# EAGLE schematic NILMCape (EAGLE 6.4)

## Sheet 1 of 5
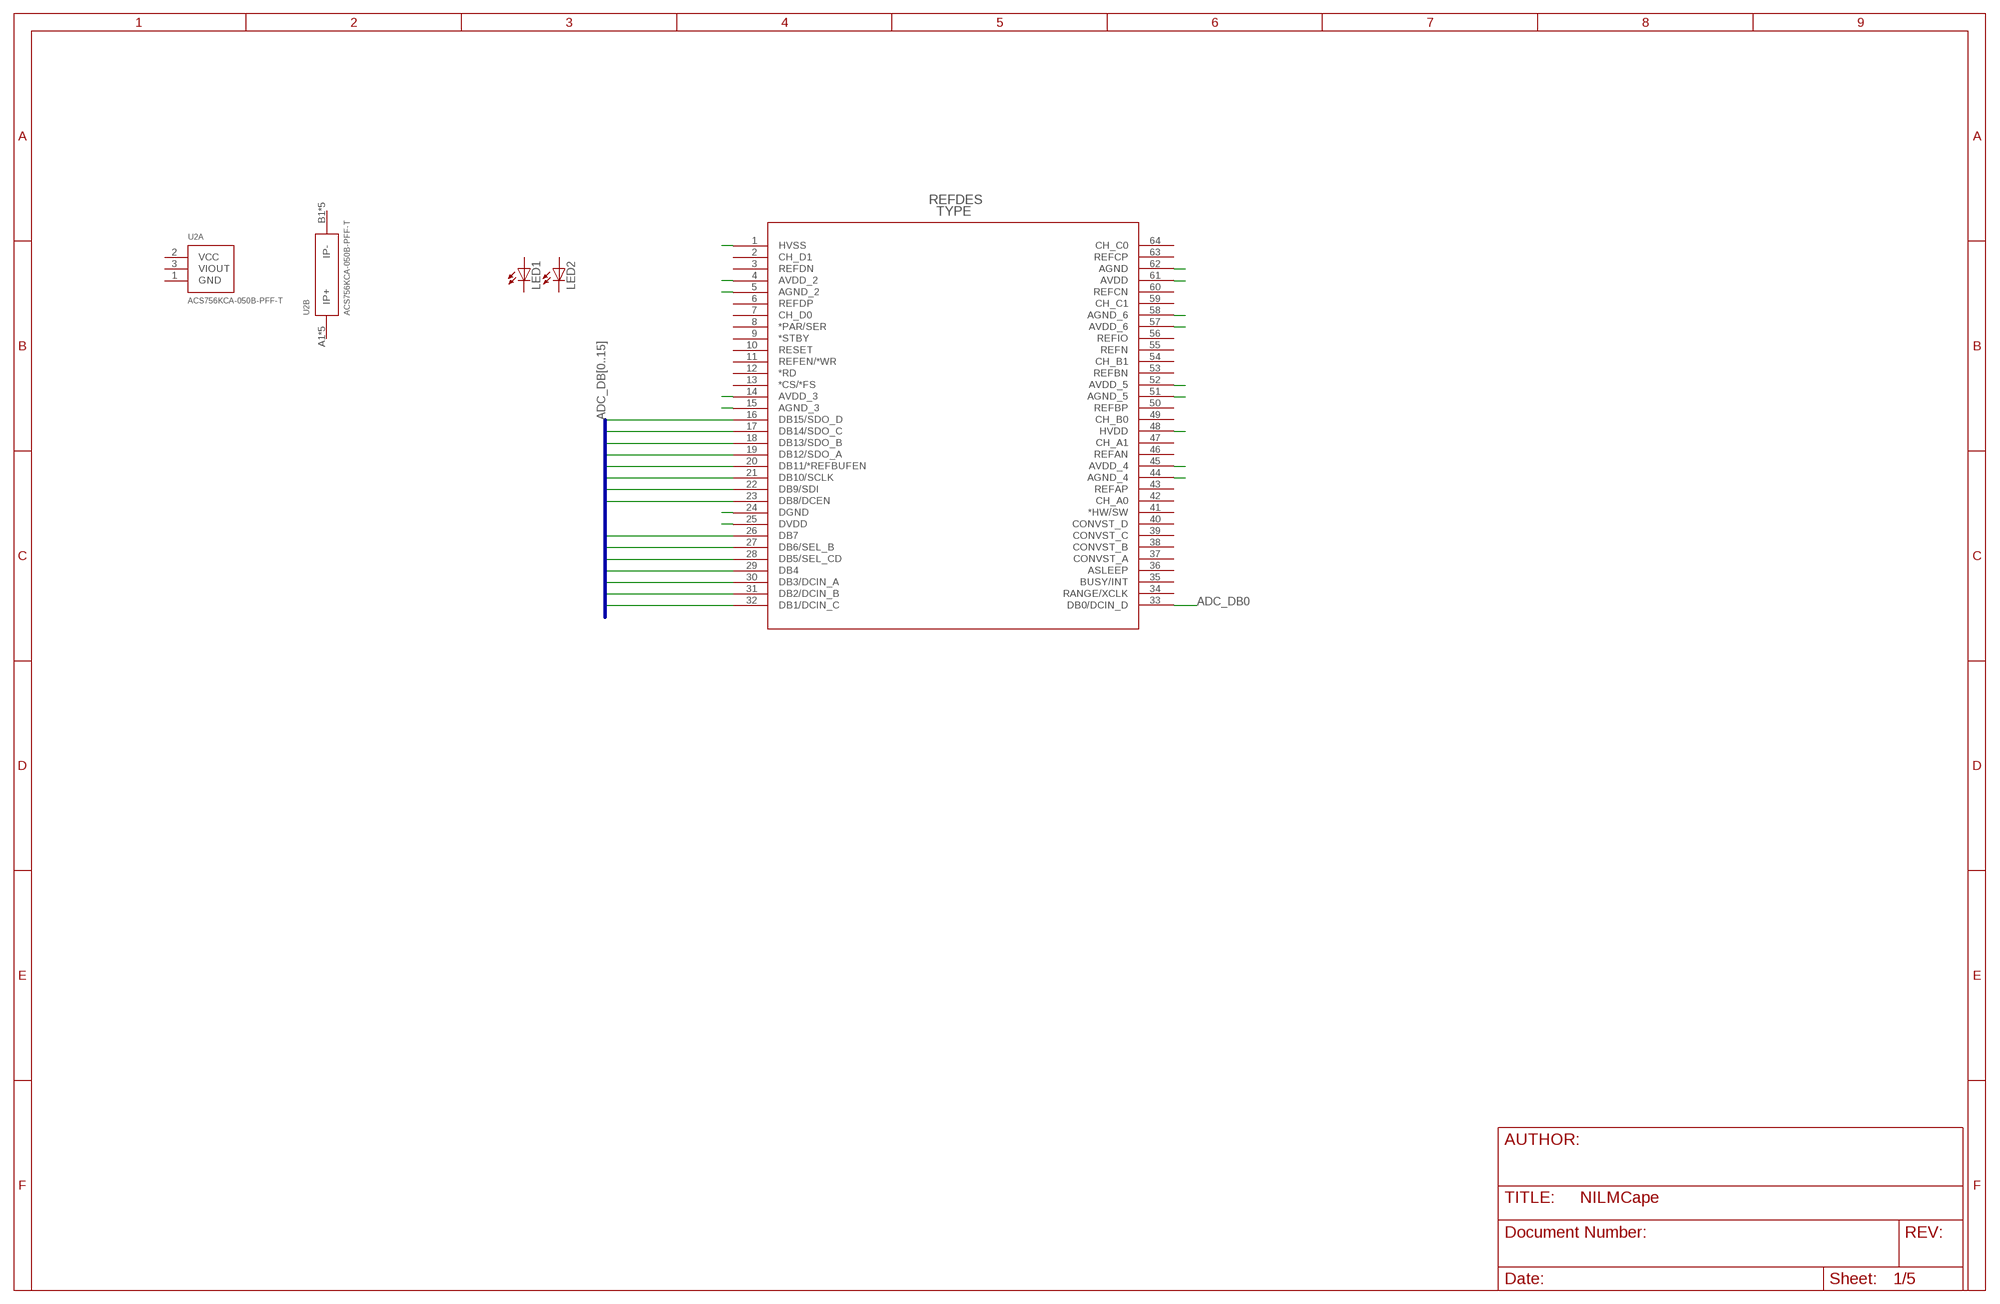
[diagram p0: schematic, sheet 1]

### Parts
LED1  LED0805  [LED-0805]
LED2  LED0805  [LED-0805]
U1  ADS8568_PM_64  [PM64]
U2  ACS756KCA-050B-PFF-T  [5PFF]

### Nets
ADC_DB0: U1.33(DB0/DCIN_D) ; also sheet 4
ADC_DB1: U1.32(DB1/DCIN_C) ; also sheet 4
ADC_DB2: U1.31(DB2/DCIN_B) ; also sheet 4
ADC_DB3: U1.30(DB3/DCIN_A) ; also sheet 4
ADC_DB4: U1.29(DB4) ; also sheet 4
ADC_DB5: U1.28(DB5/SEL_CD) ; also sheet 4
ADC_DB6: U1.27(DB6/SEL_B) ; also sheet 4
ADC_DB7: U1.26(DB7) ; also sheet 4
ADC_DB8: U1.23(DB8/DCEN) ; also sheet 4
ADC_DB9: U1.22(DB9/SDI) ; also sheet 4
ADC_DB10: U1.21(DB10/SCLK) ; also sheet 4
ADC_DB11: U1.20(DB11/*REFBUFEN) ; also sheet 4
ADC_DB12: U1.19(DB12/SDO_A) ; also sheet 4
ADC_DB13: U1.18(DB13/SDO_B) ; also sheet 4
ADC_DB14: U1.17(DB14/SDO_C) ; also sheet 4
ADC_DB15: U1.16(DB15/SDO_D) ; also sheet 4
HVSS: U1.1(HVSS) ; also sheet 2
N$6: U1.25(DVDD)
N$7: U1.14(AVDD_3)
N$8: U1.4(AVDD_2)
N$12: U1.5(AGND_2)
N$19: U1.15(AGND_3)
N$20: U1.24(DGND)
N$21: U1.44(AGND_4)
N$22: U1.45(AVDD_4)
N$23: U1.48(HVDD)
N$24: U1.51(AGND_5)
N$25: U1.52(AVDD_5)
N$26: U1.57(AVDD_6)
N$27: U1.58(AGND_6)
N$28: U1.61(AVDD)
N$29: U1.62(AGND)
Unconnected: LED1.1(A) LED1.2(C) LED2.1(A) LED2.2(C) U1.2(CH_D1) U1.3(REFDN) U1.6(REFDP) U1.7(CH_D0) U1.8(*PAR/SER) U1.9(*STBY) U1.10(RESET) U1.11(REFEN/*WR) U1.12(*RD) U1.13(*CS/*FS) U1.34(RANGE/XCLK) U1.35(BUSY/INT) U1.36(ASLEEP) U1.37(CONVST_A) U1.38(CONVST_B) U1.39(CONVST_C) U1.40(CONVST_D) U1.41(*HW/SW) U1.42(CH_A0) U1.43(REFAP) U1.46(REFAN) U1.47(CH_A1) U1.49(CH_B0) U1.50(REFBP) U1.53(REFBN) U1.54(CH_B1) U1.55(REFN) U1.56(REFIO) U1.59(CH_C1) U1.60(REFCN) U1.63(REFCP) U1.64(CH_C0) U2.1(A:GND) U2.2(A:VCC) U2.3(A:VIOUT) U2.A1(B:IP+) U2.A2(B:IP+) U2.A3(B:IP+) U2.A4(B:IP+) U2.A5(B:IP+) U2.B1(B:IP-) U2.B2(B:IP-) U2.B3(B:IP-) U2.B4(B:IP-) U2.B5(B:IP-)

### Buses
ADC_DB[0..15]

## Sheet 2 of 5
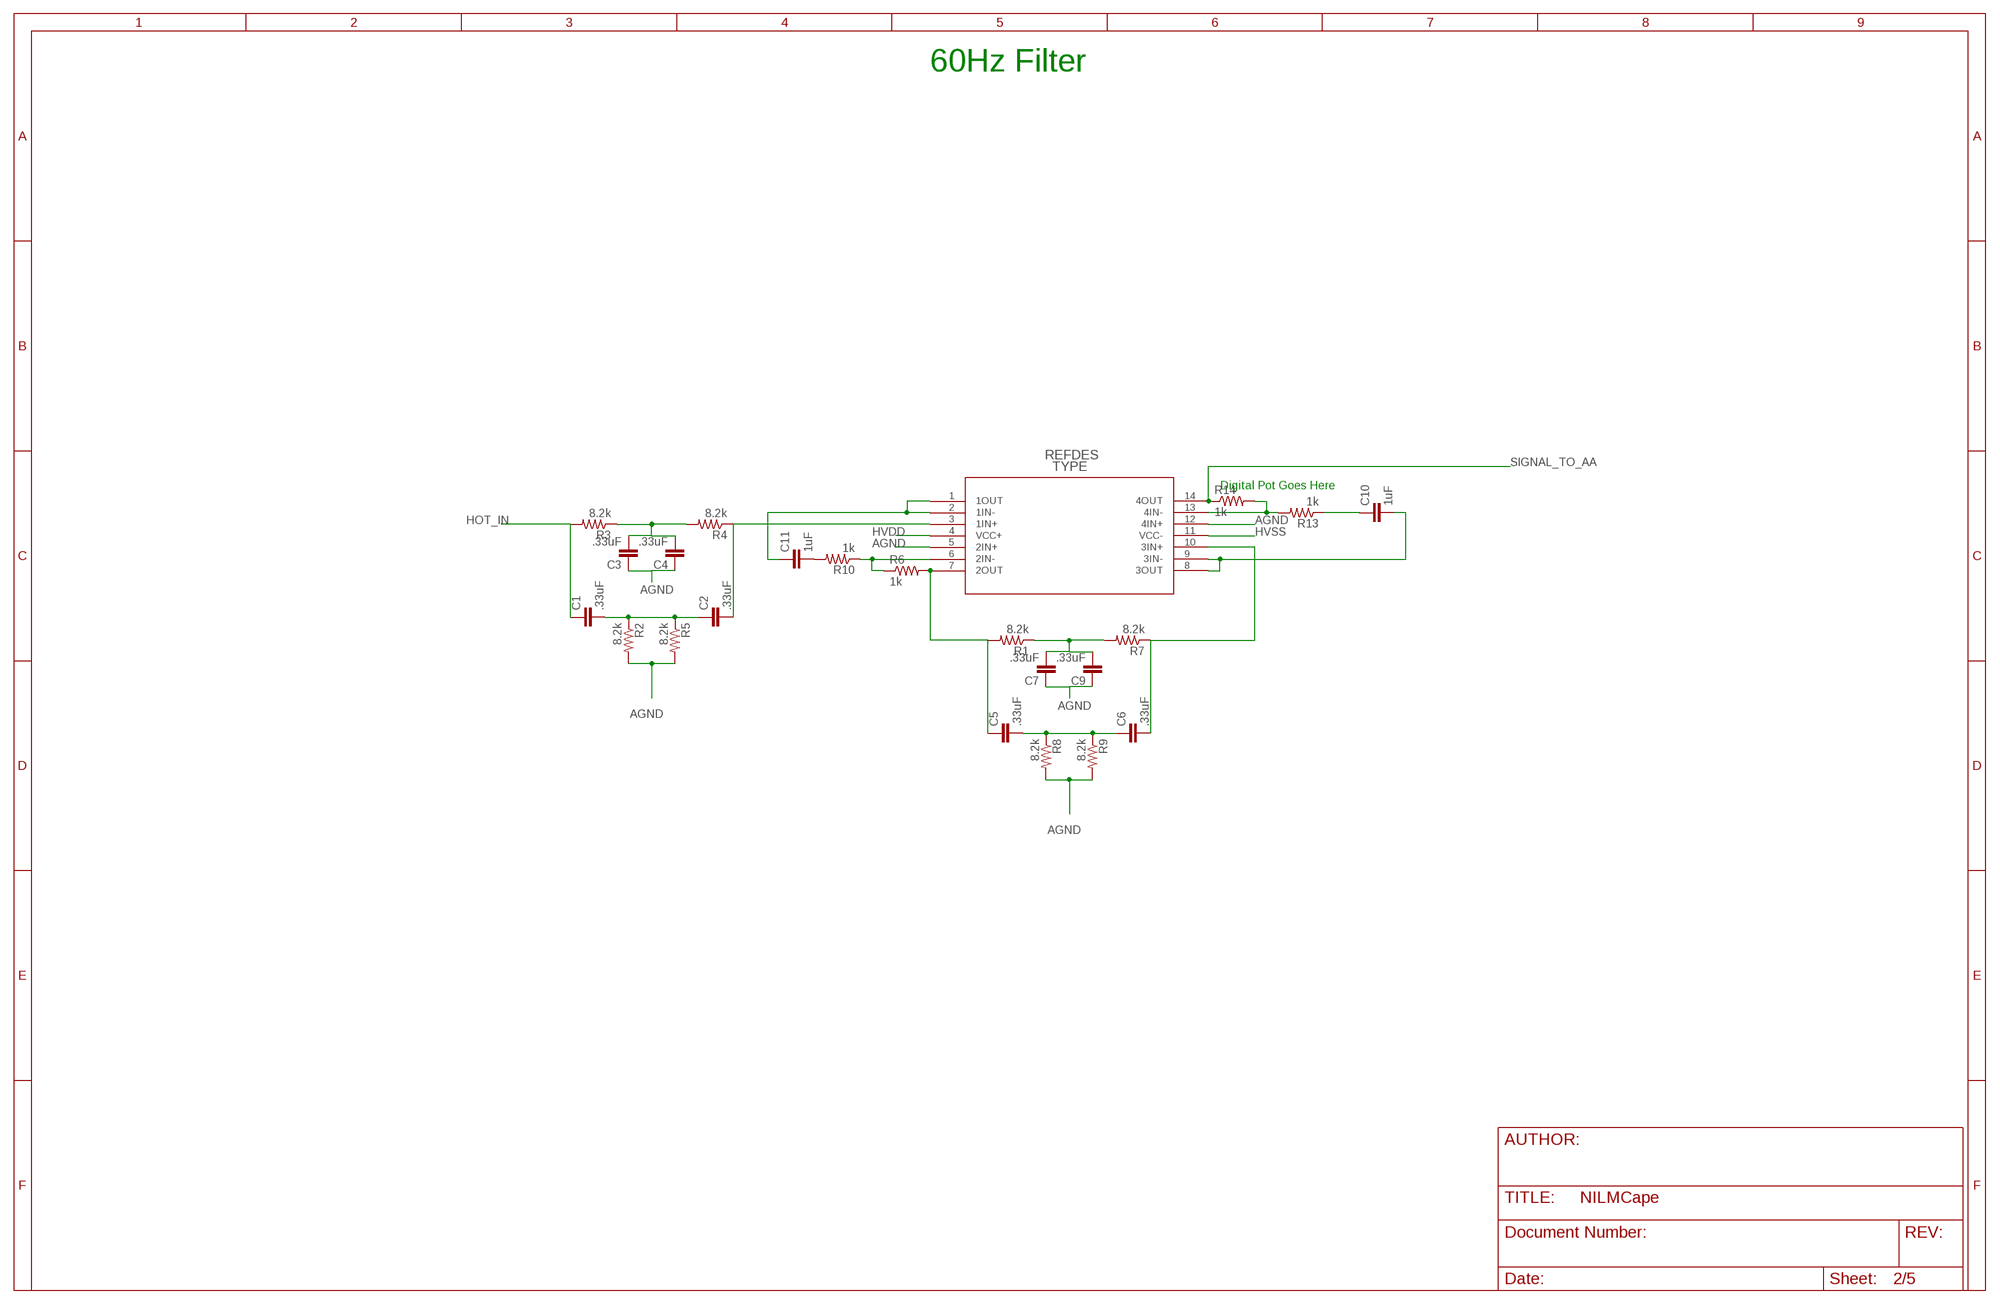
[diagram p1: schematic, sheet 2]

### Parts
C1  .33uF  CAP0805  [0805]
C2  .33uF  CAP0805  [0805]
C3  .33uF  CAP0805  [0805]
C4  .33uF  CAP0805  [0805]
C5  .33uF  CAP0805  [0805]
C6  .33uF  CAP0805  [0805]
C7  .33uF  CAP0805  [0805]
C9  .33uF  CAP0805  [0805]
C10  1uF  CAP0805  [0805]
C11  1uF  CAP0805  [0805]
R1  8.2k  RESISTOR0805-RES  [0805]
R2  8.2k  RESISTOR0805-RES  [0805]
R3  8.2k  RESISTOR0805-RES  [0805]
R4  8.2k  RESISTOR0805-RES  [0805]
R5  8.2k  RESISTOR0805-RES  [0805]
R6  1k  RESISTOR0805-RES  [0805]
R7  8.2k  RESISTOR0805-RES  [0805]
R8  8.2k  RESISTOR0805-RES  [0805]
R9  8.2k  RESISTOR0805-RES  [0805]
R10  1k  RESISTOR0805-RES  [0805]
R13  1k  RESISTOR0805-RES  [0805]
R14  1k  RESISTOR0805-RES  [0805]
U9  TL074_PW_14  [PW14]

### Nets
AGND: C3.1 C4.1 C7.1 C9.1 R2.2 R5.2 R8.2 R9.2 U9.5(2IN+) U9.12(4IN+)
HOT_IN: C1.1 R3.2
HVDD: U9.4(VCC+)
HVSS: U9.11(VCC-) ; also sheet 1
N$1: C5.1 R1.2 R6.2 U9.7(2OUT)
N$3: C1.2 C2.1 R2.1 R5.1
N$4: C3.2 C4.2 R3.1 R4.2
N$5: R6.1 R10.1 U9.6(2IN-)
N$9: C2.2 R4.1 U9.3(1IN+)
N$10: C5.2 C6.1 R8.1 R9.1
N$11: C7.2 C9.2 R1.1 R7.2
N$13: C6.2 R7.1 U9.10(3IN+)
N$14: C10.2 U9.8(3OUT) U9.9(3IN-)
N$17: R13.2 R14.2 U9.13(4IN-)
N$30: C10.1 R13.1
N$34: C11.2 R10.2
N$35: C11.1 U9.1(1OUT) U9.2(1IN-)
SIGNAL_TO_AA: R14.1 U9.14(4OUT)

### Notes on the sheet
- 60Hz Filter
- Digital Pot Goes Here

## Sheet 3 of 5
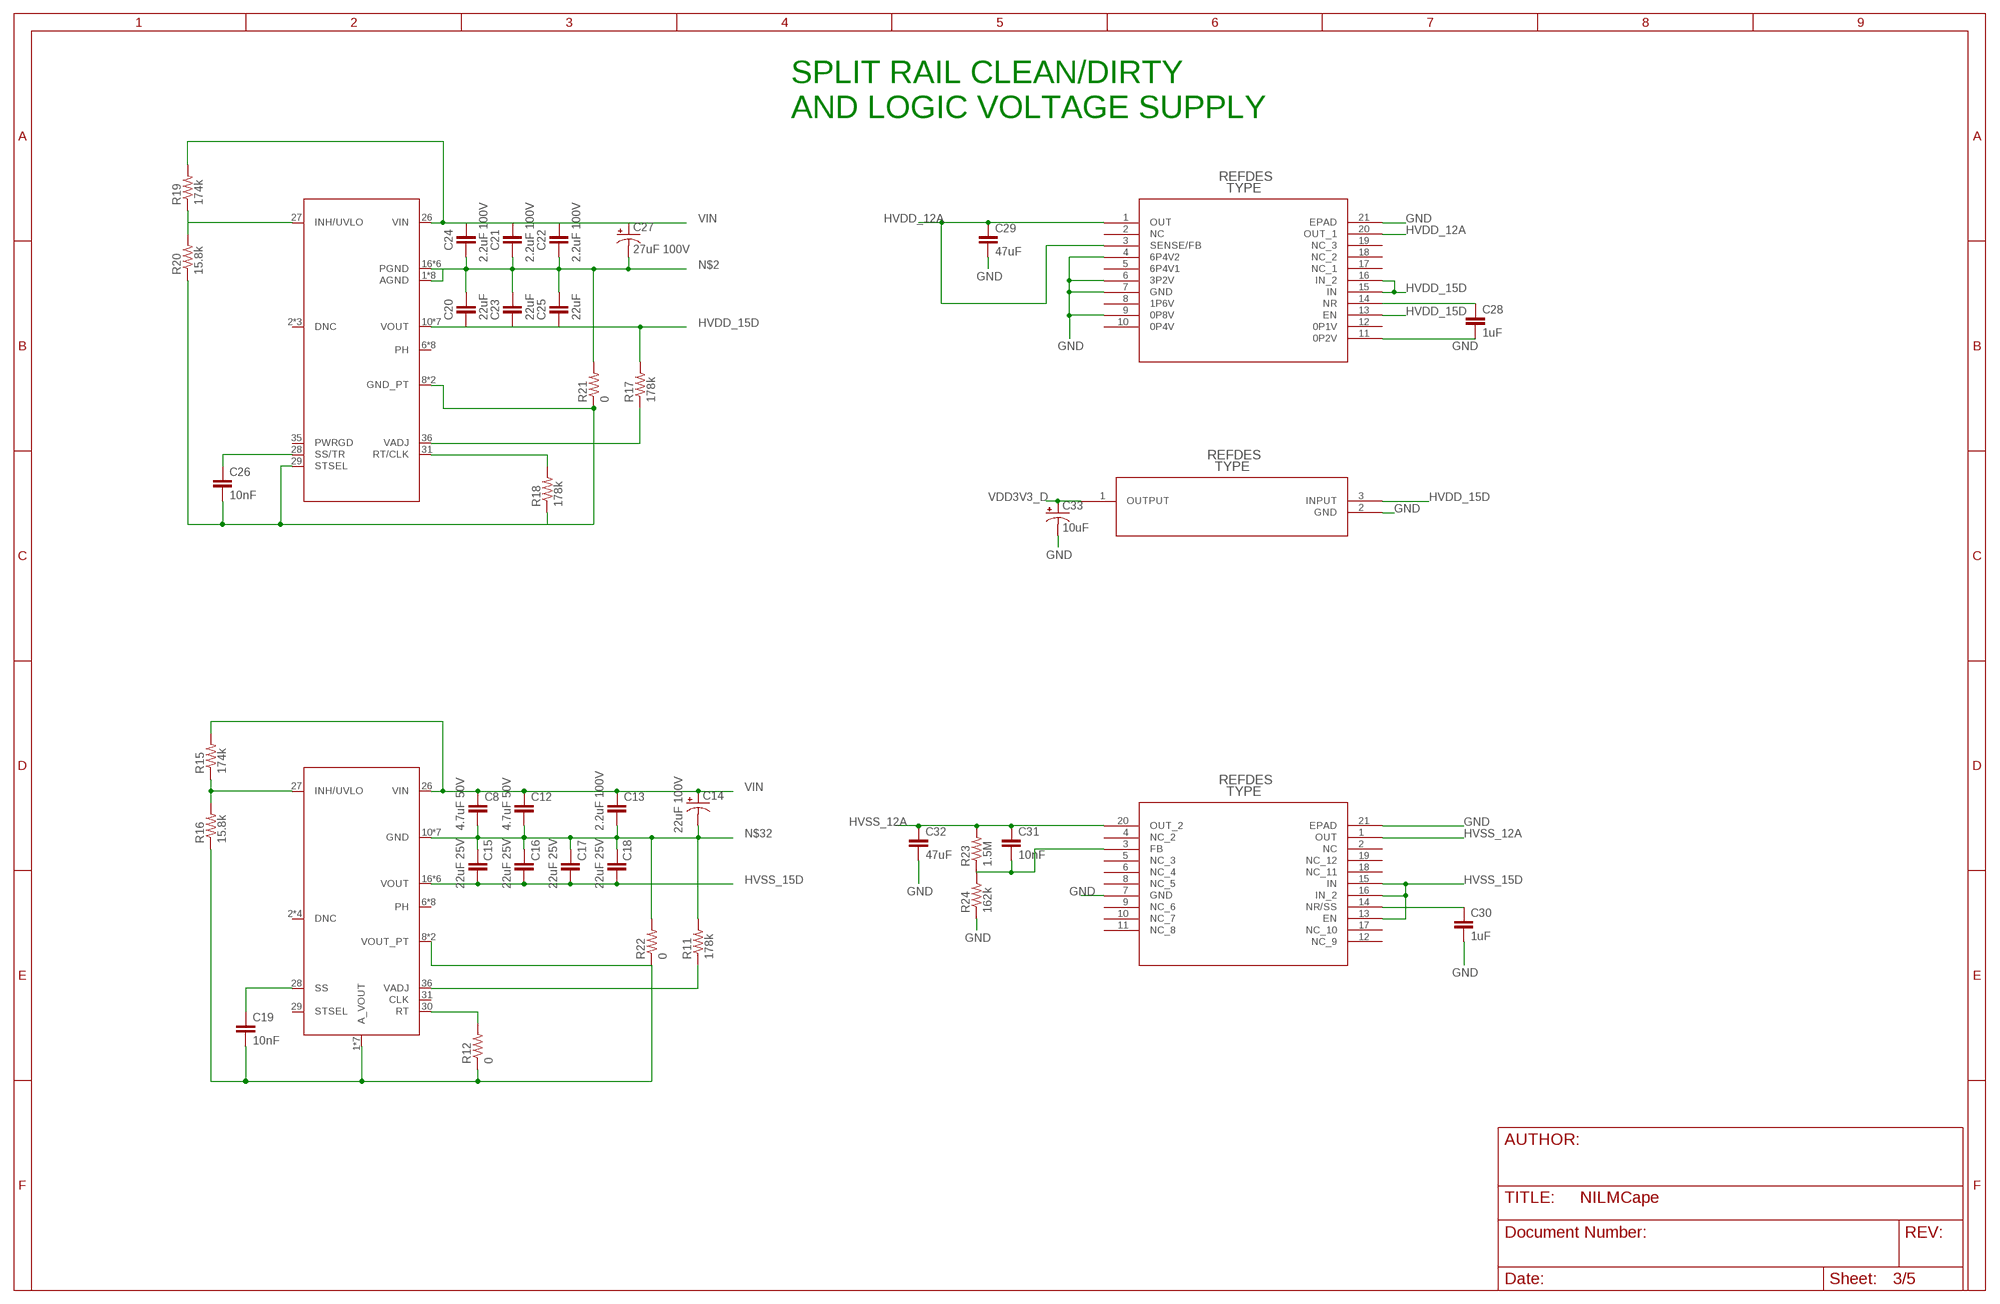
[diagram p2: schematic, sheet 3]

### Parts
C8  4.7uF 50V  CAP1210  [1210]
C12  4.7uF 50V  CAP1210  [1210]
C13  2.2uF 100V  CAP1210  [1210]
C14  22uF 100V  CAP_POLPTH1  [CPOL-RADIAL-100UF-25V]
C15  22uF 25V  CAP1210  [1210]
C16  22uF 25V  CAP1210  [1210]
C17  22uF 25V  CAP1210  [1210]
C18  22uF 25V  CAP1210  [1210]
C19  10nF  CAP0805  [0805]
C20  22uF  CAP1210  [1210]
C21  2.2uF 100V  CAP1210  [1210]
C22  2.2uF 100V  CAP1210  [1210]
C23  22uF  CAP1210  [1210]
C24  2.2uF 100V  CAP1210  [1210]
C25  22uF  CAP1210  [1210]
C26  10nF  CAP0805  [0805]
C27  27uF 100V  CAP_POLPTH1  [CPOL-RADIAL-100UF-25V]
C28  1uF  CAP0805  [0805]
C29  47uF  CAP1210  [1210]
C30  1uF  CAP0805  [0805]
C31  10nF  CAP0805  [0805]
C32  47uF  CAP1210  [1210]
C33  10uF  CAP_POLPTH2  [CPOL-RADIAL-10UF-25V]
R11  178k  RESISTOR0805-RES  [0805]
R12  0  RESISTOR0805-RES  [0805]
R15  174k  RESISTOR0805-RES  [0805]
R16  15.8k  RESISTOR0805-RES  [0805]
R17  178k  RESISTOR0805-RES  [0805]
R18  178k  RESISTOR0805-RES  [0805]
R19  174k  RESISTOR0805-RES  [0805]
R20  15.8k  RESISTOR0805-RES  [0805]
R21  0  RESISTOR0805-RES  [0805]
R22  0  RESISTOR0805-RES  [0805]
R23  1.5M  RESISTOR0805-RES  [0805]
R24  162k  RESISTOR0805-RES  [0805]
U5  TPS84250_RKG_41  [RKG41]
U6  TPS7A3301_RGW_20  [RGW20_3P15X3P15]
U7  LP2950-33_KVU_3  [KVU3]
U$2  TPS84259_RKG_41  [RKG41]
U$3  TPS7A4700_RGW_20  [RGW20_3P15X3P15]

### Nets
GND: C19.2 C28.2 C29.2 C30.2 C32.2 C33.2(-) R12.1 R16.1 R22.1 R24.1 U6.7(GND) U6.21(EPAD) U7.2(GND) U$2.1(A_VOUT) U$2.4(A_VOUT) U$2.5(A_VOUT) U$2.8(VOUT_PT) U$2.9(VOUT_PT) U$2.32(A_VOUT) U$2.33(A_VOUT) U$2.34(A_VOUT) U$2.37(A_VOUT) U$3.4(6P4V2) U$3.6(3P2V) U$3.7(GND) U$3.9(0P8V) U$3.11(0P2V) U$3.21(EPAD) ; also sheet 4
HVDD_12A: C29.1 U$3.1(OUT) U$3.3(SENSE/FB) U$3.20(OUT_1)
HVDD_15D: C20.2 C23.2 C25.2 R17.2 U5.10(VOUT) U5.11(VOUT) U5.12(VOUT) U5.13(VOUT) U5.14(VOUT) U5.15(VOUT) U5.39(VOUT) U7.3(INPUT) U$3.13(EN) U$3.15(IN) U$3.16(IN_2)
HVSS_12A: C31.1 C32.1 R23.2 U6.1(OUT) U6.20(OUT_2)
HVSS_15D: C15.2 C16.2 C17.2 C18.2 U6.13(EN) U6.15(IN) U6.16(IN_2) U$2.16(VOUT) U$2.17(VOUT) U$2.18(VOUT) U$2.19(VOUT) U$2.20(VOUT) U$2.40(VOUT)
N$2: C20.1 C21.2 C22.2 C23.1 C24.2 C25.1 C27.2(-) R21.2 U5.1(AGND) U5.4(AGND) U5.5(AGND) U5.16(PGND) U5.17(PGND) U5.18(PGND) U5.19(PGND) U5.20(PGND) U5.30(AGND) U5.32(AGND) U5.33(AGND) U5.34(AGND) U5.37(AGND) U5.40(PGND)
N$15: C19.1 U$2.28(SS)
N$16: C31.2 R24.2 U6.3(FB)
N$18: R11.1 U$2.36(VADJ)
N$31: R12.2 U$2.30(RT)
N$32: C8.2 C12.2 C13.2 C14.2(-) C15.1 C16.1 C17.1 C18.1 R11.2 R22.2 U$2.10(GND) U$2.11(GND) U$2.12(GND) U$2.13(GND) U$2.14(GND) U$2.15(GND) U$2.39(GND)
N$33: C30.1 U6.14(NR/SS)
N$36: R15.1 R16.2 U$2.27(INH/UVLO)
N$37: R17.1 U5.36(VADJ)
N$38: R18.2 U5.31(RT/CLK)
N$41: R19.1 R20.2 U5.27(INH/UVLO)
N$43: C26.1 U5.28(SS/TR)
N$44: C26.2 R18.1 R20.1 R21.1 U5.8(GND_PT) U5.9(GND_PT) U5.29(STSEL)
N$45: C28.1 U$3.14(NR)
VDD3V3_D: C33.1(+) U7.1(OUTPUT) ; also sheet 4
VIN: C8.1 C12.1 C13.1 C14.1(+) C21.1 C22.1 C24.1 C27.1(+) R15.2 R19.2 U5.26(VIN) U$2.26(VIN)
Unconnected: R23.1 U5.2(DNC) U5.3(DNC) U5.6(PH) U5.7(PH) U5.21(PH) U5.22(PH) U5.23(PH) U5.24(PH) U5.25(DNC) U5.35(PWRGD) U5.38(PH) U5.41(PH) U6.2(NC) U6.4(NC_2) U6.5(NC_3) U6.6(NC_4) U6.8(NC_5) U6.9(NC_6) U6.10(NC_7) U6.11(NC_8) U6.12(NC_9) U6.17(NC_10) U6.18(NC_11) U6.19(NC_12) U$2.2(DNC) U$2.3(DNC) U$2.6(PH) U$2.7(PH) U$2.21(PH) U$2.22(PH) U$2.23(PH) U$2.24(PH) U$2.25(DNC) U$2.29(STSEL) U$2.31(CLK) U$2.35(DNC) U$2.38(PH) U$2.41(PH) U$3.2(NC) U$3.5(6P4V1) U$3.8(1P6V) U$3.10(0P4V) U$3.12(0P1V) U$3.17(NC_1) U$3.18(NC_2) U$3.19(NC_3)

### Notes on the sheet
- SPLIT RAIL CLEAN/DIRTY
  AND LOGIC VOLTAGE SUPPLY

## Sheet 4 of 5
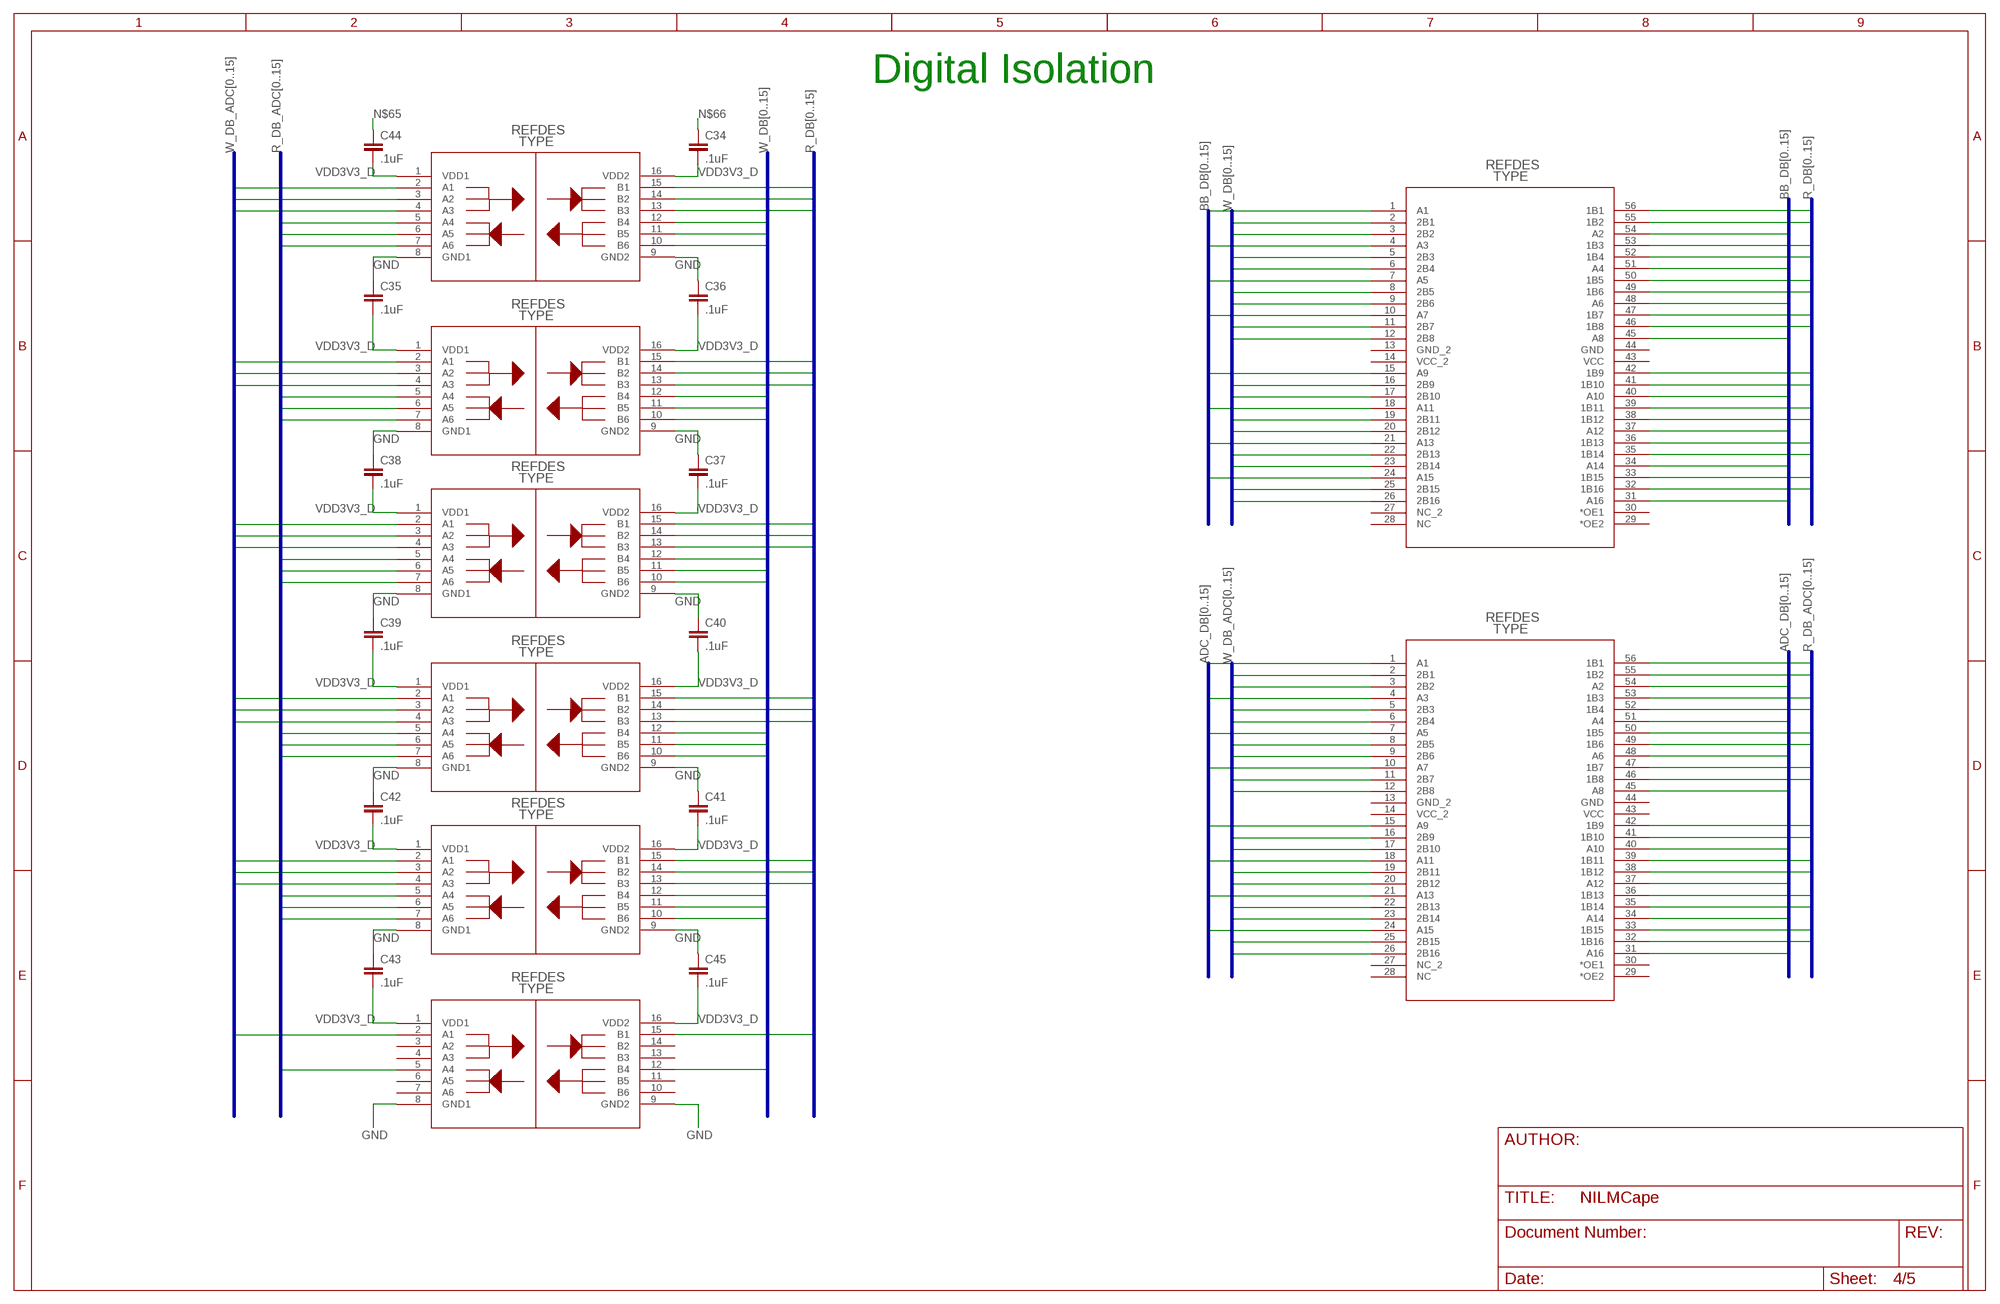
[diagram p3: schematic, sheet 4]

### Parts
C34  .1uF  CAP0805  [0805]
C35  .1uF  CAP0805  [0805]
C36  .1uF  CAP0805  [0805]
C37  .1uF  CAP0805  [0805]
C38  .1uF  CAP0805  [0805]
C39  .1uF  CAP0805  [0805]
C40  .1uF  CAP0805  [0805]
C41  .1uF  CAP0805  [0805]
C42  .1uF  CAP0805  [0805]
C43  .1uF  CAP0805  [0805]
C44  .1uF  CAP0805  [0805]
C45  .1uF  CAP0805  [0805]
U3  SI8663BC-B-IS1  [SOIC-16]
U4  SN74CBT16390_DGG  [DGG56]
U8  SI8663BC-B-IS1  [SOIC-16]
U10  SI8663BC-B-IS1  [SOIC-16]
U11  SI8663BC-B-IS1  [SOIC-16]
U12  SI8663BC-B-IS1  [SOIC-16]
U13  SI8663BC-B-IS1  [SOIC-16]
U14  SN74CBT16390_DGG  [DGG56]

### Nets
ADC_DB0: U14.1(A1) ; also sheet 1
ADC_DB1: U14.54(A2) ; also sheet 1
ADC_DB2: U14.4(A3) ; also sheet 1
ADC_DB3: U14.51(A4) ; also sheet 1
ADC_DB4: U14.7(A5) ; also sheet 1
ADC_DB5: U14.48(A6) ; also sheet 1
ADC_DB6: U14.10(A7) ; also sheet 1
ADC_DB7: U14.45(A8) ; also sheet 1
ADC_DB8: U14.15(A9) ; also sheet 1
ADC_DB9: U14.40(A10) ; also sheet 1
ADC_DB10: U14.18(A11) ; also sheet 1
ADC_DB11: U14.37(A12) ; also sheet 1
ADC_DB12: U14.21(A13) ; also sheet 1
ADC_DB13: U14.34(A14) ; also sheet 1
ADC_DB14: U14.24(A15) ; also sheet 1
ADC_DB15: U14.31(A16) ; also sheet 1
BB_DB0: U4.1(A1) ; also sheet 5
BB_DB1: U4.54(A2) ; also sheet 5
BB_DB2: U4.4(A3) ; also sheet 5
BB_DB3: U4.51(A4) ; also sheet 5
BB_DB4: U4.7(A5) ; also sheet 5
BB_DB5: U4.48(A6) ; also sheet 5
BB_DB6: U4.10(A7) ; also sheet 5
BB_DB7: U4.45(A8) ; also sheet 5
BB_DB8: U4.15(A9) ; also sheet 5
BB_DB9: U4.40(A10) ; also sheet 5
BB_DB10: U4.18(A11) ; also sheet 5
BB_DB11: U4.37(A12) ; also sheet 5
BB_DB12: U4.21(A13) ; also sheet 5
BB_DB13: U4.34(A14) ; also sheet 5
BB_DB14: U4.24(A15) ; also sheet 5
BB_DB15: U4.31(A16) ; also sheet 5
GND: C35.1 C36.1 C37.1 C38.1 C39.1 C40.1 C41.1 C42.1 C43.1 C45.1 U3.8(GND1) U3.9(GND2) U8.8(GND1) U8.9(GND2) U10.8(GND1) U10.9(GND2) U11.8(GND1) U11.9(GND2) U12.8(GND1) U12.9(GND2) U13.8(GND1) U13.9(GND2) ; also sheet 3
N$65: C44.1
N$66: C34.1
R_DB0: U4.56(1B1) U12.15(B1)
R_DB1: U4.55(1B2) U12.14(B2)
R_DB2: U4.53(1B3) U12.13(B3)
R_DB3: U4.52(1B4) U11.15(B1)
R_DB4: U4.50(1B5) U11.14(B2)
R_DB5: U4.49(1B6) U11.13(B3)
R_DB6: U4.47(1B7) U10.15(B1)
R_DB7: U4.46(1B8) U10.14(B2)
R_DB8: U4.42(1B9) U10.13(B3)
R_DB9: U3.15(B1) U4.41(1B10)
R_DB10: U3.14(B2) U4.39(1B11)
R_DB11: U3.13(B3) U4.38(1B12)
R_DB12: U4.36(1B13) U8.15(B1)
R_DB13: U4.35(1B14) U8.14(B2)
R_DB14: U4.33(1B15) U8.13(B3)
R_DB15: U4.32(1B16) U13.15(B1)
R_DB_ADC0: U12.5(A4) U14.56(1B1)
R_DB_ADC1: U12.6(A5) U14.55(1B2)
R_DB_ADC2: U12.7(A6) U14.53(1B3)
R_DB_ADC3: U11.5(A4) U14.52(1B4)
R_DB_ADC4: U11.6(A5) U14.50(1B5)
R_DB_ADC5: U11.7(A6) U14.49(1B6)
R_DB_ADC6: U10.5(A4) U14.47(1B7)
R_DB_ADC7: U10.6(A5) U14.46(1B8)
R_DB_ADC8: U10.7(A6) U14.42(1B9)
R_DB_ADC9: U3.5(A4) U14.41(1B10)
R_DB_ADC10: U3.6(A5) U14.39(1B11)
R_DB_ADC11: U3.7(A6) U14.38(1B12)
R_DB_ADC12: U8.5(A4) U14.36(1B13)
R_DB_ADC13: U8.6(A5) U14.35(1B14)
R_DB_ADC14: U8.7(A6) U14.33(1B15)
R_DB_ADC15: U13.5(A4) U14.32(1B16)
VDD3V3_D: C34.2 C35.2 C36.2 C37.2 C38.2 C39.2 C40.2 C41.2 C42.2 C43.2 C44.2 C45.2 U3.1(VDD1) U3.16(VDD2) U8.1(VDD1) U8.16(VDD2) U10.1(VDD1) U10.16(VDD2) U11.1(VDD1) U11.16(VDD2) U12.1(VDD1) U12.16(VDD2) U13.1(VDD1) U13.16(VDD2) ; also sheet 3
W_DB0: U4.2(2B1) U12.12(B4)
W_DB1: U4.3(2B2) U12.11(B5)
W_DB2: U4.5(2B3) U12.10(B6)
W_DB3: U4.6(2B4) U11.12(B4)
W_DB4: U4.8(2B5) U11.11(B5)
W_DB5: U4.9(2B6) U11.10(B6)
W_DB6: U4.11(2B7) U10.12(B4)
W_DB7: U4.12(2B8) U10.11(B5)
W_DB8: U4.16(2B9) U10.10(B6)
W_DB9: U3.12(B4) U4.17(2B10)
W_DB10: U3.11(B5) U4.19(2B11)
W_DB11: U3.10(B6) U4.20(2B12)
W_DB12: U4.22(2B13) U8.12(B4)
W_DB13: U4.23(2B14) U8.11(B5)
W_DB14: U4.25(2B15) U8.10(B6)
W_DB15: U4.26(2B16) U13.12(B4)
W_DB_ADC0: U12.2(A1) U14.2(2B1)
W_DB_ADC1: U12.3(A2) U14.3(2B2)
W_DB_ADC2: U12.4(A3) U14.5(2B3)
W_DB_ADC3: U11.2(A1) U14.6(2B4)
W_DB_ADC4: U11.3(A2) U14.8(2B5)
W_DB_ADC5: U14.9(2B6)
W_DB_ADC6: U10.2(A1) U11.4(A3) U14.11(2B7)
W_DB_ADC7: U10.3(A2) U14.12(2B8)
W_DB_ADC8: U10.4(A3) U14.16(2B9)
W_DB_ADC9: U3.2(A1) U14.17(2B10)
W_DB_ADC10: U3.3(A2) U14.19(2B11)
W_DB_ADC11: U3.4(A3) U14.20(2B12)
W_DB_ADC12: U8.2(A1) U14.22(2B13)
W_DB_ADC13: U8.3(A2) U14.23(2B14)
W_DB_ADC14: U8.4(A3) U14.25(2B15)
W_DB_ADC15: U13.2(A1) U14.26(2B16)
Unconnected: U4.13(GND_2) U4.14(VCC_2) U4.27(NC_2) U4.28(NC) U4.29(*OE2) U4.30(*OE1) U4.43(VCC) U4.44(GND) U13.3(A2) U13.4(A3) U13.6(A5) U13.7(A6) U13.10(B6) U13.11(B5) U13.13(B3) U13.14(B2) U14.13(GND_2) U14.14(VCC_2) U14.27(NC_2) U14.28(NC) U14.29(*OE2) U14.30(*OE1) U14.43(VCC) U14.44(GND)

### Buses
BB_DB[0..15]
W_DB[0..15]
R_DB[0..15]
W_DB_ADC[0..15]
R_DB_ADC[0..15]
ADC_DB[0..15]

### Notes on the sheet
- Digital Isolation

## Sheet 5 of 5
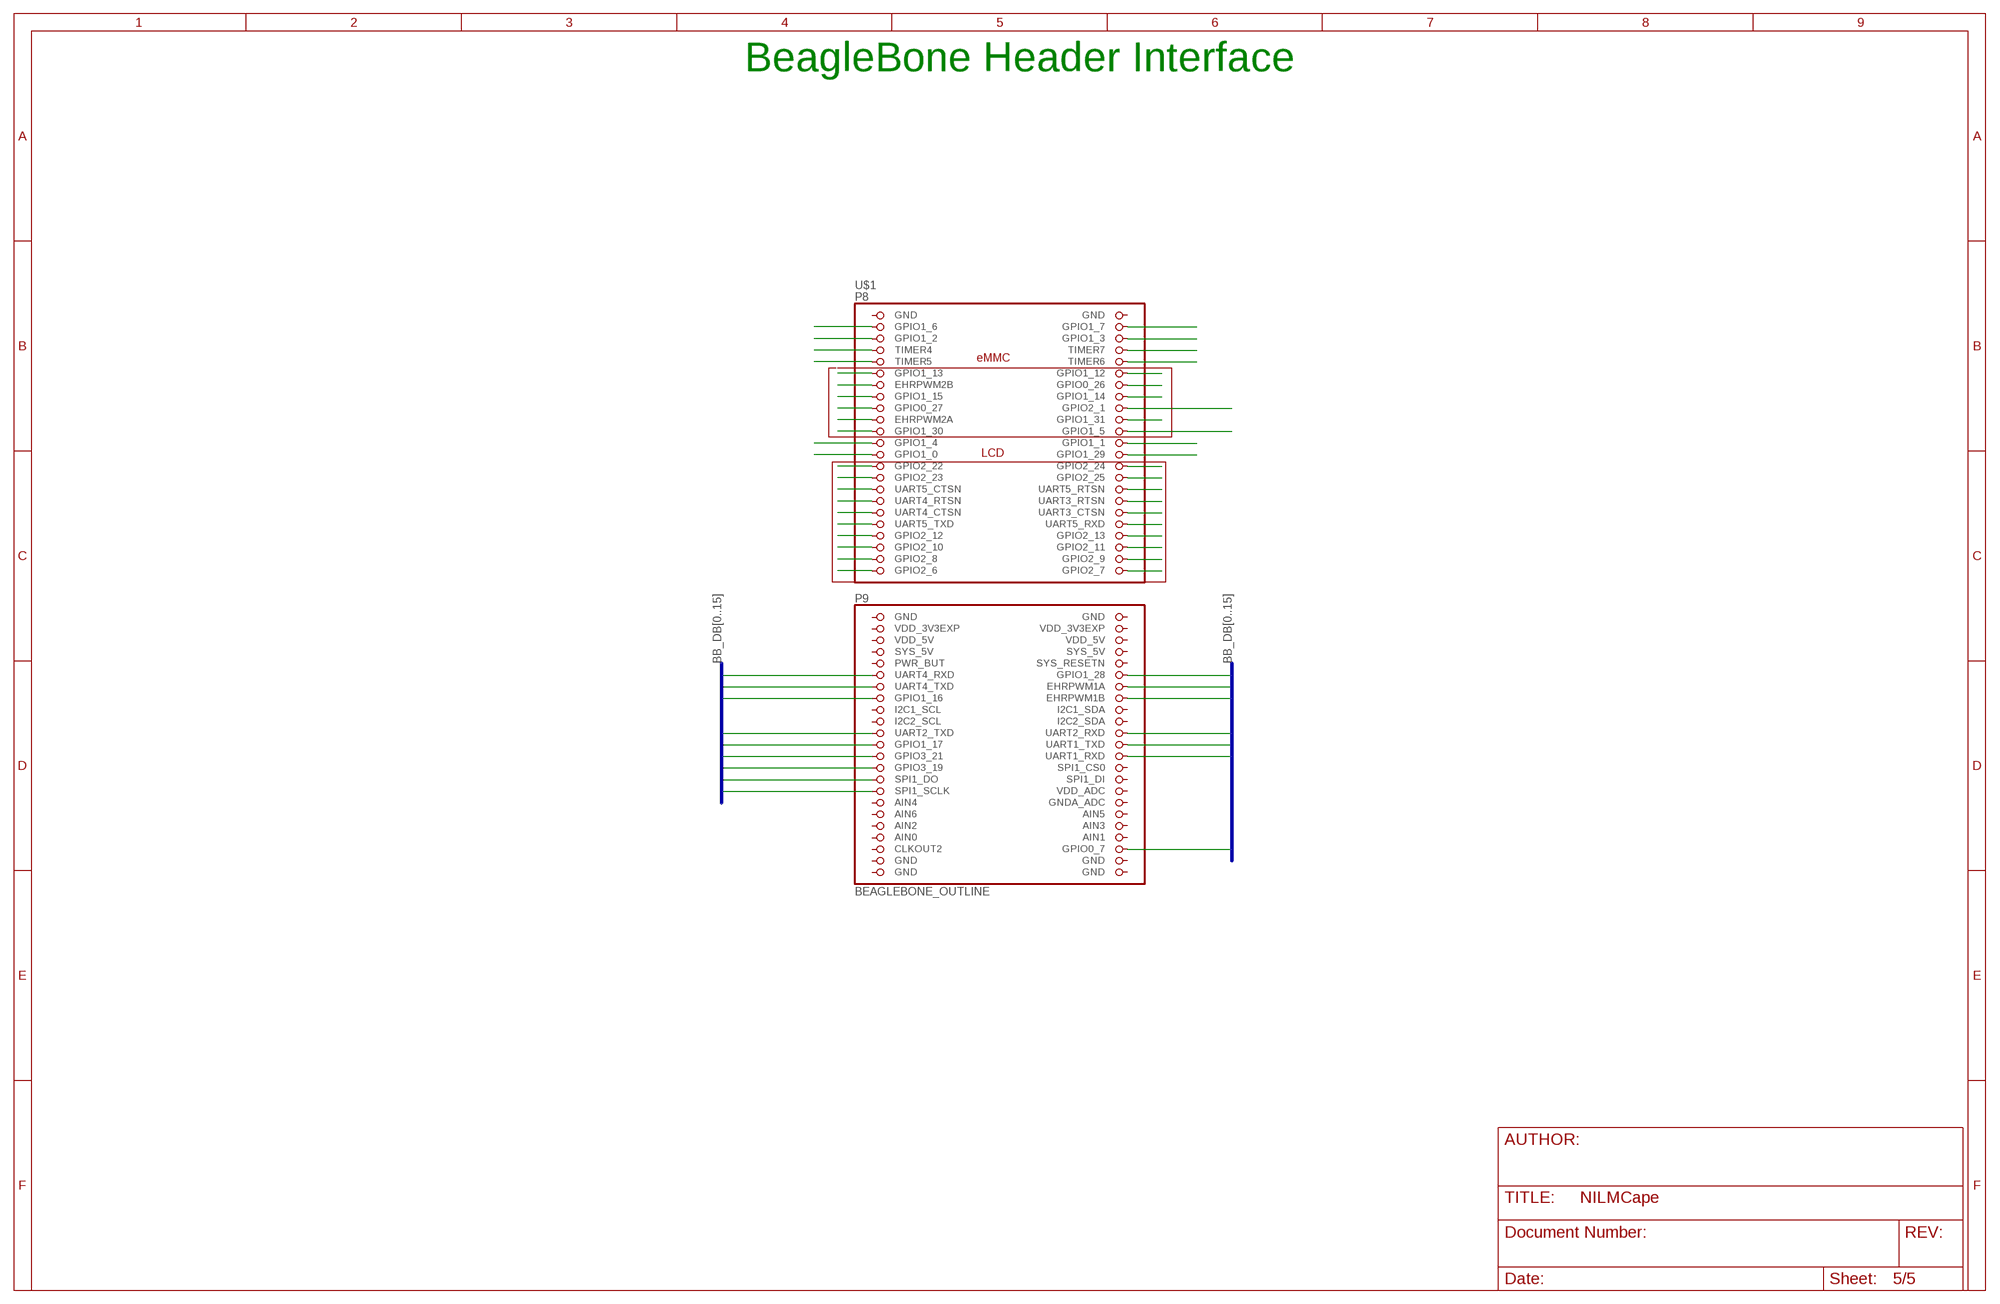
[diagram p4: schematic, sheet 5]

### Parts
U$1  BEAGLEBONE_OUTLINE  [BEAGLEBONE_SHIELD]

### Nets
BB_DB0: U$1.57(UART4_RXD) ; also sheet 4
BB_DB1: U$1.59(UART4_TXD) ; also sheet 4
BB_DB2: U$1.61(GPIO1_16) ; also sheet 4
BB_DB3: U$1.67(UART2_TXD) ; also sheet 4
BB_DB4: U$1.69(GPIO1_17) ; also sheet 4
BB_DB5: U$1.71(GPIO3_21) ; also sheet 4
BB_DB6: U$1.73(GPIO3_19) ; also sheet 4
BB_DB7: U$1.75(SPI1_DO) ; also sheet 4
BB_DB8: U$1.77(SPI1_SCLK) ; also sheet 4
BB_DB9: U$1.58(GPIO1_28) ; also sheet 4
BB_DB10: U$1.60(EHRPWM1A) ; also sheet 4
BB_DB11: U$1.62(EHRPWM1B) ; also sheet 4
BB_DB12: U$1.68(UART2_RXD) ; also sheet 4
BB_DB13: U$1.70(UART1_TXD) ; also sheet 4
BB_DB14: U$1.72(UART1_RXD) ; also sheet 4
BB_DB15: U$1.88(GPIO0_7) ; also sheet 4
N$39: U$1.27(GPIO2_22)
N$40: U$1.29(GPIO2_23)
N$42: U$1.28(GPIO2_24)
N$46: U$1.30(GPIO2_25)
N$47: U$1.31(UART5_CTSN)
N$48: U$1.33(UART4_RTSN)
N$49: U$1.35(UART4_CTSN)
N$50: U$1.37(UART5_TXD)
N$51: U$1.32(UART5_RTSN)
N$52: U$1.34(UART3_RTSN)
N$53: U$1.36(UART3_CTSN)
N$54: U$1.38(UART5_RXD)
N$55: U$1.45(GPIO2_6)
N$56: U$1.46(GPIO2_7)
N$57: U$1.43(GPIO2_8)
N$58: U$1.44(GPIO2_9)
N$59: U$1.41(GPIO2_10)
N$60: U$1.42(GPIO2_11)
N$61: U$1.39(GPIO2_12)
N$62: U$1.40(GPIO2_13)
N$63: U$1.11(GPIO1_13)
N$64: U$1.12(GPIO1_12)
N$67: U$1.13(EHRPWM2B)
N$68: U$1.14(GPIO0_26)
N$69: U$1.15(GPIO1_15)
N$70: U$1.16(GPIO1_14)
N$71: U$1.17(GPIO0_27)
N$72: U$1.19(EHRPWM2A)
N$73: U$1.20(GPIO1_31)
N$74: U$1.21(GPIO1_30)
N$75: U$1.18(GPIO2_1)
N$76: U$1.22(GPIO1_5)
N$77: U$1.7(TIMER4)
N$78: U$1.3(GPIO1_6)
N$79: U$1.5(GPIO1_2)
N$80: U$1.4(GPIO1_7)
N$81: U$1.6(GPIO1_3)
N$82: U$1.24(GPIO1_1)
N$83: U$1.26(GPIO1_29)
N$84: U$1.23(GPIO1_4)
N$85: U$1.25(GPIO1_0)
N$90: U$1.9(TIMER5)
N$91: U$1.8(TIMER7)
N$92: U$1.10(TIMER6)
Unconnected: U$1.54(SYS_5V) U$1.55(PWR_BUT) U$1.56(SYS_RESETN) U$1.63(I2C1_SCL) U$1.64(I2C1_SDA) U$1.65(I2C2_SCL) U$1.66(I2C2_SDA) U$1.74(SPI1_CS0) U$1.76(SPI1_DI) U$1.78(VDD_ADC) U$1.79(AIN4) U$1.80(GNDA_ADC) U$1.81(AIN6) U$1.82(AIN5) U$1.83(AIN2) U$1.84(AIN3) U$1.86(AIN1) U$1.87(CLKOUT2)

### Buses
BB_DB[0..15]

### Notes on the sheet
- BeagleBone Header Interface
- eMMC
- LCD

## Power pins joined to a net without a drawn wire
AIN0: U$1.85(AIN0)
GND: U$1.1(GND) U$1.2(GND) U$1.47(GND) U$1.48(GND) U$1.89(GND) U$1.90(GND) U$1.91(GND) U$1.92(GND)
SYS_5V: U$1.53(SYS_5V)
VDD_3V3EXP: U$1.49(VDD_3V3EXP) U$1.50(VDD_3V3EXP)
VDD_5V: U$1.51(VDD_5V) U$1.52(VDD_5V)

## Library data of the parts
C1-C13 C15-C26 C28-C32 C34-C45 = SensorCape:CAP: Capacitor Standard 0603 ceramic capacitor, and 0.1" leaded capacitor.
C14 = ASL:CAP_POL: Capacitor Polarized These are standard SMD and PTH capacitors. Normally 10uF, 47uF, and 100uF in electrolytic and tantalum varieties. Always verify the external diameter of the through hole cap, it varies with capacity, voltage, and manufacturer. The EIA devices should be standard.
C27 C33 = SensorCape:CAP_POL: Capacitor Polarized These are standard SMD and PTH capacitors. Normally 10uF, 47uF, and 100uF in electrolytic and tantalum varieties. Always verify the external diameter of the through hole cap, it varies with capacity, voltage, and manufacturer. The EIA devices should be standard.
LED1 LED2 = SensorCape:LED: LEDs Standard schematic elements and footprints for 5mm, 3mm, 1206, and 0603 sized LEDs. 5mm - Spark Fun Electronics SKU : COM-00529 (and others)
R1-R10 R13 R14 = SensorCape:RESISTOR: Resistor Basic schematic elements and footprints for 0603, 1206, and PTH resistors.
R11 R12 R15-R24 = ASL:RESISTOR: Resistor Basic schematic elements and footprints for 0603, 1206, and PTH resistors.
U1 = SensorCape:ADS8568_PM_64
U2 = SensorCape:ACS756; TEMP: -40 to +125
U3 U8 U10-U13 = SensorCape:SI8663BC-B-IS1
U4 U14 = SensorCape:SN74CBT16390_DGG
U5 = SensorCape:TPS84250_RKG_41
U6 = SensorCape:TPS7A3301_RGW_20
U7 = SensorCape:LP2950-33_KVU_3
U9 = SensorCape:TL074_PW_14
U$1 = SensorCape:BEAGLEBONE_OUTLINE: Should match A3 pinout - but not completely tested
U$2 = SensorCape:TPS84259_RKG_41
U$3 = SensorCape:TPS7A4700_RGW_20